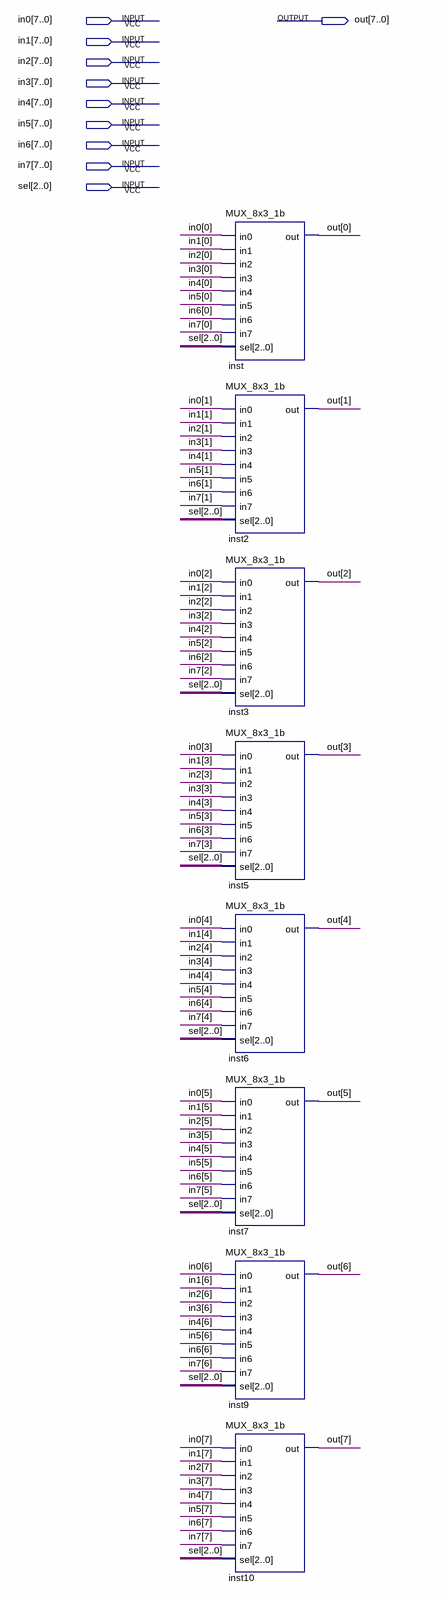
[diagram p0: schematic sheet]
// Quartus schematic MUX_8x3_8b.bdf as structural Verilog: 8 symbols, 10 pins
module MUX_8x3_8b (
  input  [7:0] in0,
  input  [7:0] in1,
  input  [7:0] in2,
  input  [7:0] in3,
  input  [7:0] in4,
  input  [7:0] in5,
  input  [7:0] in6,
  input  [7:0] in7,
  input  [2:0] sel,
  output [7:0] out
);

  MUX_8x3_1b inst (
    .in0(in0[0]), .in1(in1[0]), .in2(in2[0]), .in3(in3[0]), .in4(in4[0]), .in5(in5[0]), .in6(in6[0]),
    .in7(in7[0]), .sel(sel), .out(out[0]));
  MUX_8x3_1b inst2 (
    .in0(in0[1]), .in1(in1[1]), .in2(in2[1]), .in3(in3[1]), .in4(in4[1]), .in5(in5[1]), .in6(in6[1]),
    .in7(in7[1]), .sel(sel), .out(out[1]));
  MUX_8x3_1b inst3 (
    .in0(in0[2]), .in1(in1[2]), .in2(in2[2]), .in3(in3[2]), .in4(in4[2]), .in5(in5[2]), .in6(in6[2]),
    .in7(in7[2]), .sel(sel), .out(out[2]));
  MUX_8x3_1b inst5 (
    .in0(in0[3]), .in1(in1[3]), .in2(in2[3]), .in3(in3[3]), .in4(in4[3]), .in5(in5[3]), .in6(in6[3]),
    .in7(in7[3]), .sel(sel), .out(out[3]));
  MUX_8x3_1b inst6 (
    .in0(in0[4]), .in1(in1[4]), .in2(in2[4]), .in3(in3[4]), .in4(in4[4]), .in5(in5[4]), .in6(in6[4]),
    .in7(in7[4]), .sel(sel), .out(out[4]));
  MUX_8x3_1b inst7 (
    .in0(in0[5]), .in1(in1[5]), .in2(in2[5]), .in3(in3[5]), .in4(in4[5]), .in5(in5[5]), .in6(in6[5]),
    .in7(in7[5]), .sel(sel), .out(out[5]));
  MUX_8x3_1b inst9 (
    .in0(in0[6]), .in1(in1[6]), .in2(in2[6]), .in3(in3[6]), .in4(in4[6]), .in5(in5[6]), .in6(in6[6]),
    .in7(in7[6]), .sel(sel), .out(out[6]));
  MUX_8x3_1b inst10 (
    .in0(in0[7]), .in1(in1[7]), .in2(in2[7]), .in3(in3[7]), .in4(in4[7]), .in5(in5[7]), .in6(in6[7]),
    .in7(in7[7]), .sel(sel), .out(out[7]));
endmodule
